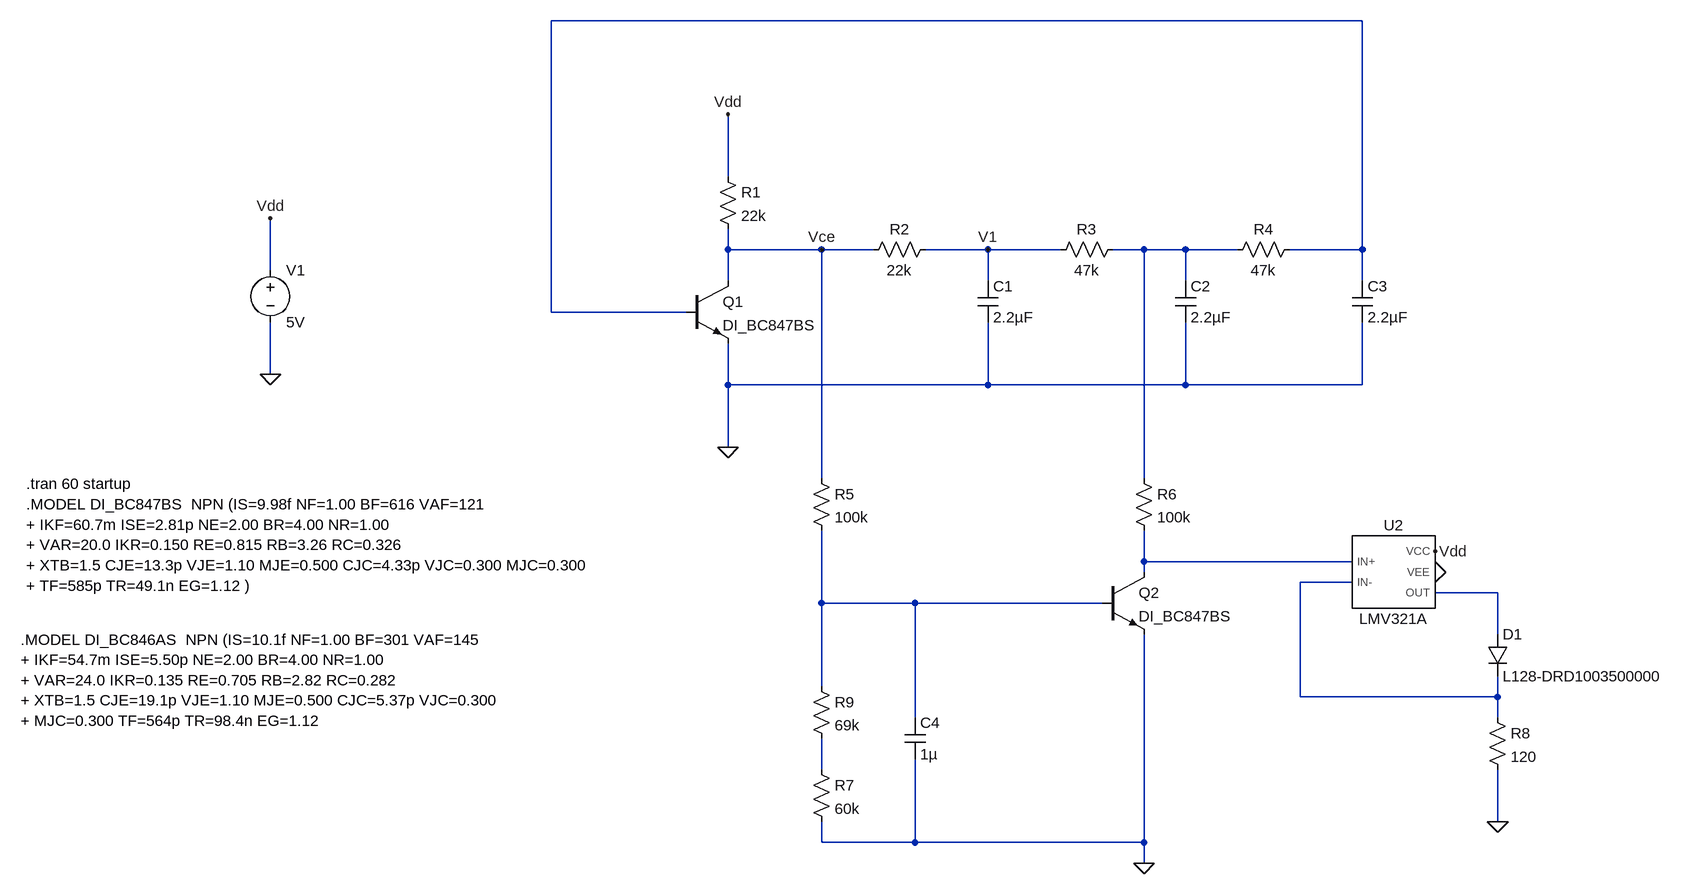
[diagram p0: schematic blinkenbrain_rev-d.asc]
blinkenbrain_rev-d.asc, the LTspice schematic file:
Version 4.1
SHEET 1 2148 1208
WIRE 1088 -208 -160 -208
WIRE 112 32 112 -64
WIRE 112 144 112 112
WIRE 256 144 112 144
WIRE 336 144 256 144
WIRE 512 144 416 144
WIRE 624 144 512 144
WIRE 752 144 704 144
WIRE 816 144 752 144
WIRE 896 144 816 144
WIRE 1088 144 1088 -208
WIRE 1088 144 976 144
WIRE -592 176 -592 96
WIRE 112 192 112 144
WIRE 512 192 512 144
WIRE 816 192 816 144
WIRE 1088 192 1088 144
WIRE -160 240 -160 -208
WIRE 48 240 -160 240
WIRE -592 336 -592 256
WIRE 112 352 112 288
WIRE 512 352 512 256
WIRE 512 352 112 352
WIRE 816 352 816 256
WIRE 816 352 512 352
WIRE 1088 352 1088 256
WIRE 1088 352 816 352
WIRE 112 448 112 352
WIRE 256 496 256 144
WIRE 752 496 752 144
WIRE 752 624 752 576
WIRE 1072 624 752 624
WIRE 752 640 752 624
WIRE 1072 656 992 656
WIRE 1296 672 1200 672
WIRE 256 688 256 576
WIRE 400 688 256 688
WIRE 688 688 400 688
WIRE 1296 736 1296 672
WIRE 256 816 256 688
WIRE 992 832 992 656
WIRE 1296 832 1296 800
WIRE 1296 832 992 832
WIRE 400 864 400 688
WIRE 1296 864 1296 832
WIRE 256 944 256 896
WIRE 1296 1024 1296 944
WIRE 256 1056 256 1024
WIRE 400 1056 400 928
WIRE 400 1056 256 1056
WIRE 752 1056 752 736
WIRE 752 1056 400 1056
WIRE 752 1088 752 1056
FLAG 112 448 0
FLAG 112 -64 Vdd
FLAG -592 336 0
FLAG -592 96 Vdd
FLAG 752 1088 0
FLAG 512 144 V1
FLAG 256 144 Vce
FLAG 1296 1024 0
FLAG 1200 640 0
FLAG 1200 608 Vdd
SYMBOL res 96 16 R0
SYMATTR InstName R1
SYMATTR Value 22k
SYMBOL res 432 128 R90
WINDOW 0 0 56 VBottom 2
WINDOW 3 32 56 VTop 2
SYMATTR InstName R2
SYMATTR Value 22k
SYMBOL res 720 128 R90
WINDOW 0 0 56 VBottom 2
WINDOW 3 32 56 VTop 2
SYMATTR InstName R3
SYMATTR Value 47k
SYMBOL res 992 128 R90
WINDOW 0 0 56 VBottom 2
WINDOW 3 32 56 VTop 2
SYMATTR InstName R4
SYMATTR Value 47k
SYMBOL cap 496 192 R0
SYMATTR InstName C1
SYMATTR Value 2.2µF
SYMBOL cap 800 192 R0
SYMATTR InstName C2
SYMATTR Value 2.2µF
SYMBOL cap 1072 192 R0
SYMATTR InstName C3
SYMATTR Value 2.2µF
SYMBOL npn 48 192 R0
SYMATTR InstName Q1
SYMATTR Value DI_BC847BS
SYMBOL voltage -592 160 R0
WINDOW 123 0 0 Left 0
WINDOW 39 0 0 Left 0
SYMATTR InstName V1
SYMATTR Value 5V
SYMBOL res 240 480 R0
SYMATTR InstName R5
SYMATTR Value 100k
SYMBOL res 736 480 R0
SYMATTR InstName R6
SYMATTR Value 100k
SYMBOL res 240 928 R0
SYMATTR InstName R7
SYMATTR Value 60k
SYMBOL cap 384 864 R0
SYMATTR InstName C4
SYMATTR Value 1µ
SYMBOL npn 688 640 R0
SYMATTR InstName Q2
SYMATTR Value DI_BC847BS
SYMBOL res 240 800 R0
SYMATTR InstName R9
SYMATTR Value 69k
SYMBOL LMV321A 1136 640 R0
SYMATTR InstName U2
SYMBOL res 1280 848 R0
SYMATTR InstName R8
SYMATTR Value 120
SYMBOL diode 1280 736 R0
SYMATTR InstName D1
SYMATTR Value L128-DRD1003500000
SYMATTR Description Diode
SYMATTR Type diode
TEXT -968 504 Left 2 !.tran 60 startup
TEXT -968 536 Left 2 !.MODEL DI_BC847BS  NPN (IS=9.98f NF=1.00 BF=616 VAF=121\n+ IKF=60.7m ISE=2.81p NE=2.00 BR=4.00 NR=1.00\n+ VAR=20.0 IKR=0.150 RE=0.815 RB=3.26 RC=0.326\n+ XTB=1.5 CJE=13.3p VJE=1.10 MJE=0.500 CJC=4.33p VJC=0.300 MJC=0.300 \n+ TF=585p TR=49.1n EG=1.12 )
TEXT -976 744 Left 2 !.MODEL DI_BC846AS  NPN (IS=10.1f NF=1.00 BF=301 VAF=145\n+ IKF=54.7m ISE=5.50p NE=2.00 BR=4.00 NR=1.00\n+ VAR=24.0 IKR=0.135 RE=0.705 RB=2.82 RC=0.282\n+ XTB=1.5 CJE=19.1p VJE=1.10 MJE=0.500 CJC=5.37p VJC=0.300\n+ MJC=0.300 TF=564p TR=98.4n EG=1.12

The netlist it stands for:
* blinkenbrain_rev-d.asc
R1 Vdd Vce 22k
R2 V1 Vce 22k
R3 N002 V1 47k
R4 N001 N002 47k
C1 V1 0 2.2µF
C2 N002 0 2.2µF
C3 N001 0 2.2µF
Q1 Vce N001 0 0 DI_BC847BS
V1 Vdd 0 5V
R5 Vce N006 100k
R6 N002 N003 100k
R7 N007 0 60k
C4 N006 0 1µ
Q2 N003 N006 0 0 DI_BC847BS
R9 N006 N007 69k
X§U2 N003 N004 Vdd 0 N005 LMV321A  ; pins IN+ IN- VCC VEE OUT
R8 N004 0 120
D1 N005 N004 L128-DRD1003500000
.model D D
.lib standard.dio
.model NPN NPN
.model PNP PNP
.lib standard.bjt
.tran 60 startup
.MODEL DI_BC847BS  NPN (IS=9.98f NF=1.00 BF=616 VAF=121
+ IKF=60.7m ISE=2.81p NE=2.00 BR=4.00 NR=1.00
+ VAR=20.0 IKR=0.150 RE=0.815 RB=3.26 RC=0.326
+ XTB=1.5 CJE=13.3p VJE=1.10 MJE=0.500 CJC=4.33p VJC=0.300 MJC=0.300
+ TF=585p TR=49.1n EG=1.12 )
.MODEL DI_BC846AS  NPN (IS=10.1f NF=1.00 BF=301 VAF=145
+ IKF=54.7m ISE=5.50p NE=2.00 BR=4.00 NR=1.00
+ VAR=24.0 IKR=0.135 RE=0.705 RB=2.82 RC=0.282
+ XTB=1.5 CJE=19.1p VJE=1.10 MJE=0.500 CJC=5.37p VJC=0.300
+ MJC=0.300 TF=564p TR=98.4n EG=1.12
.lib C:\Users\jon\public\blinkenbrain\spice\lmv321a.lib
.backanno
.end